# EAGLE board rosco_m68k (EAGLE 9.4.2)
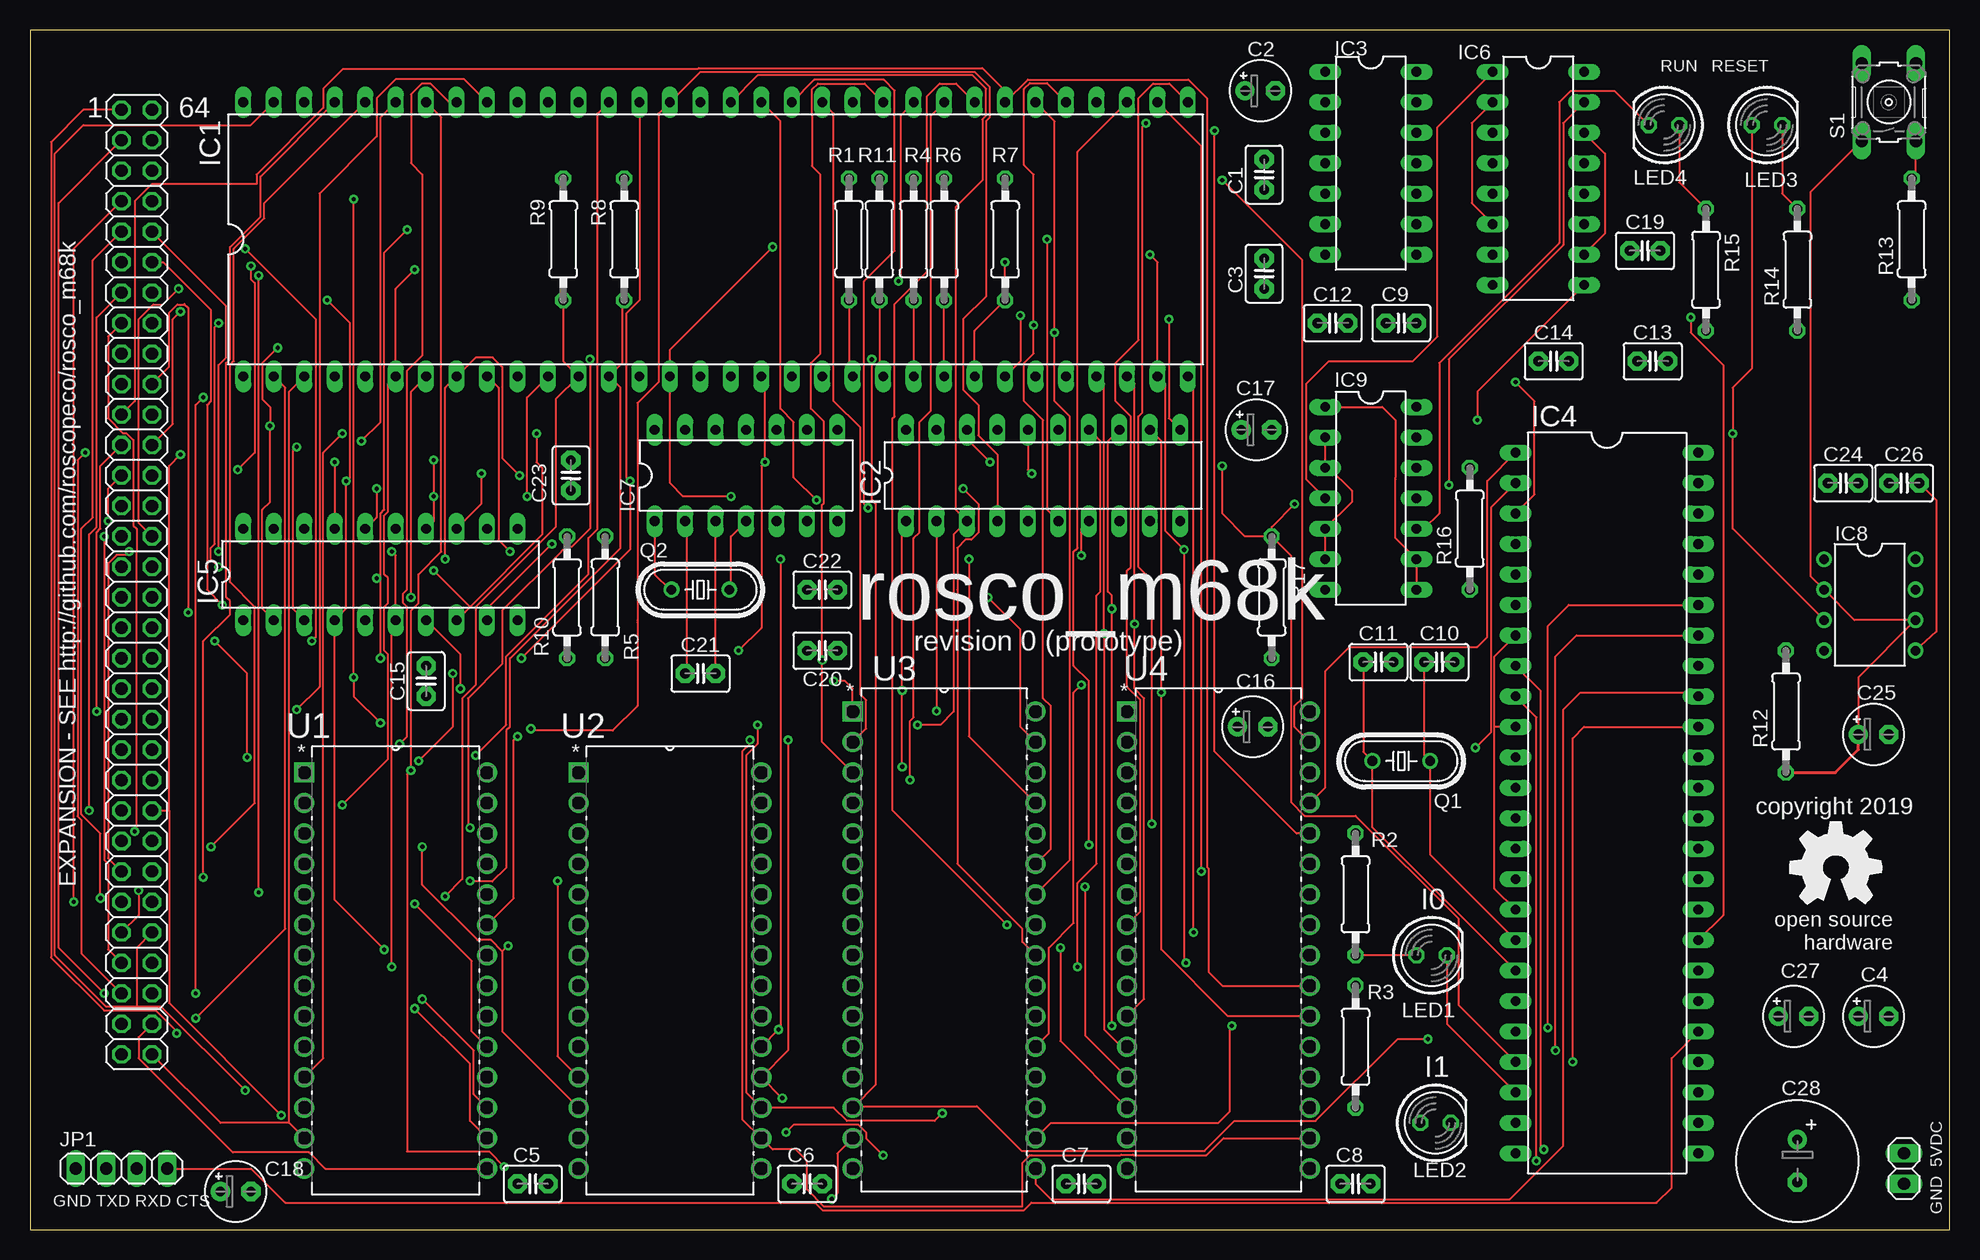
[diagram p8: board, top side]
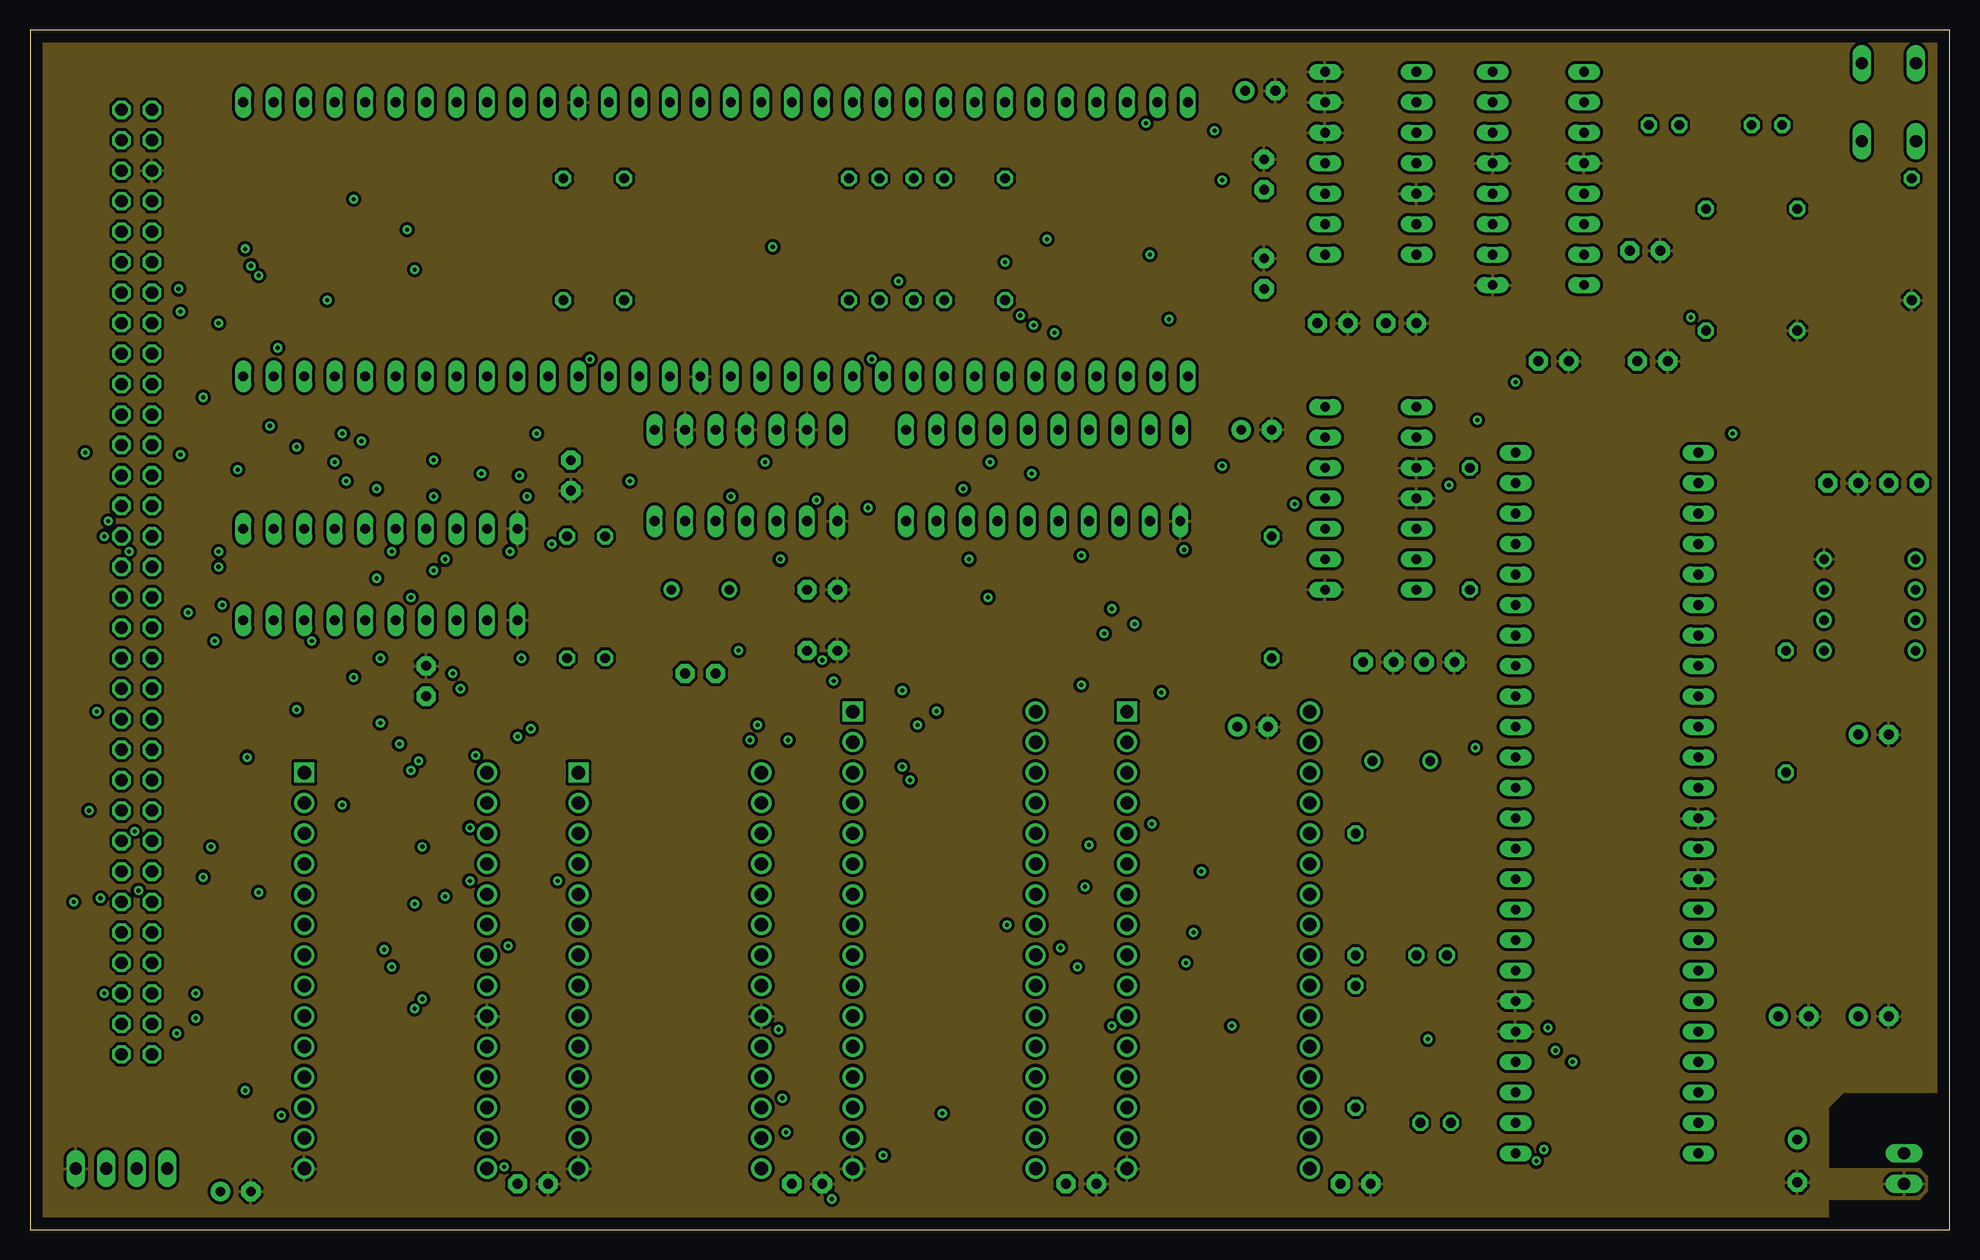
[diagram p9: board, inner layer Route2]
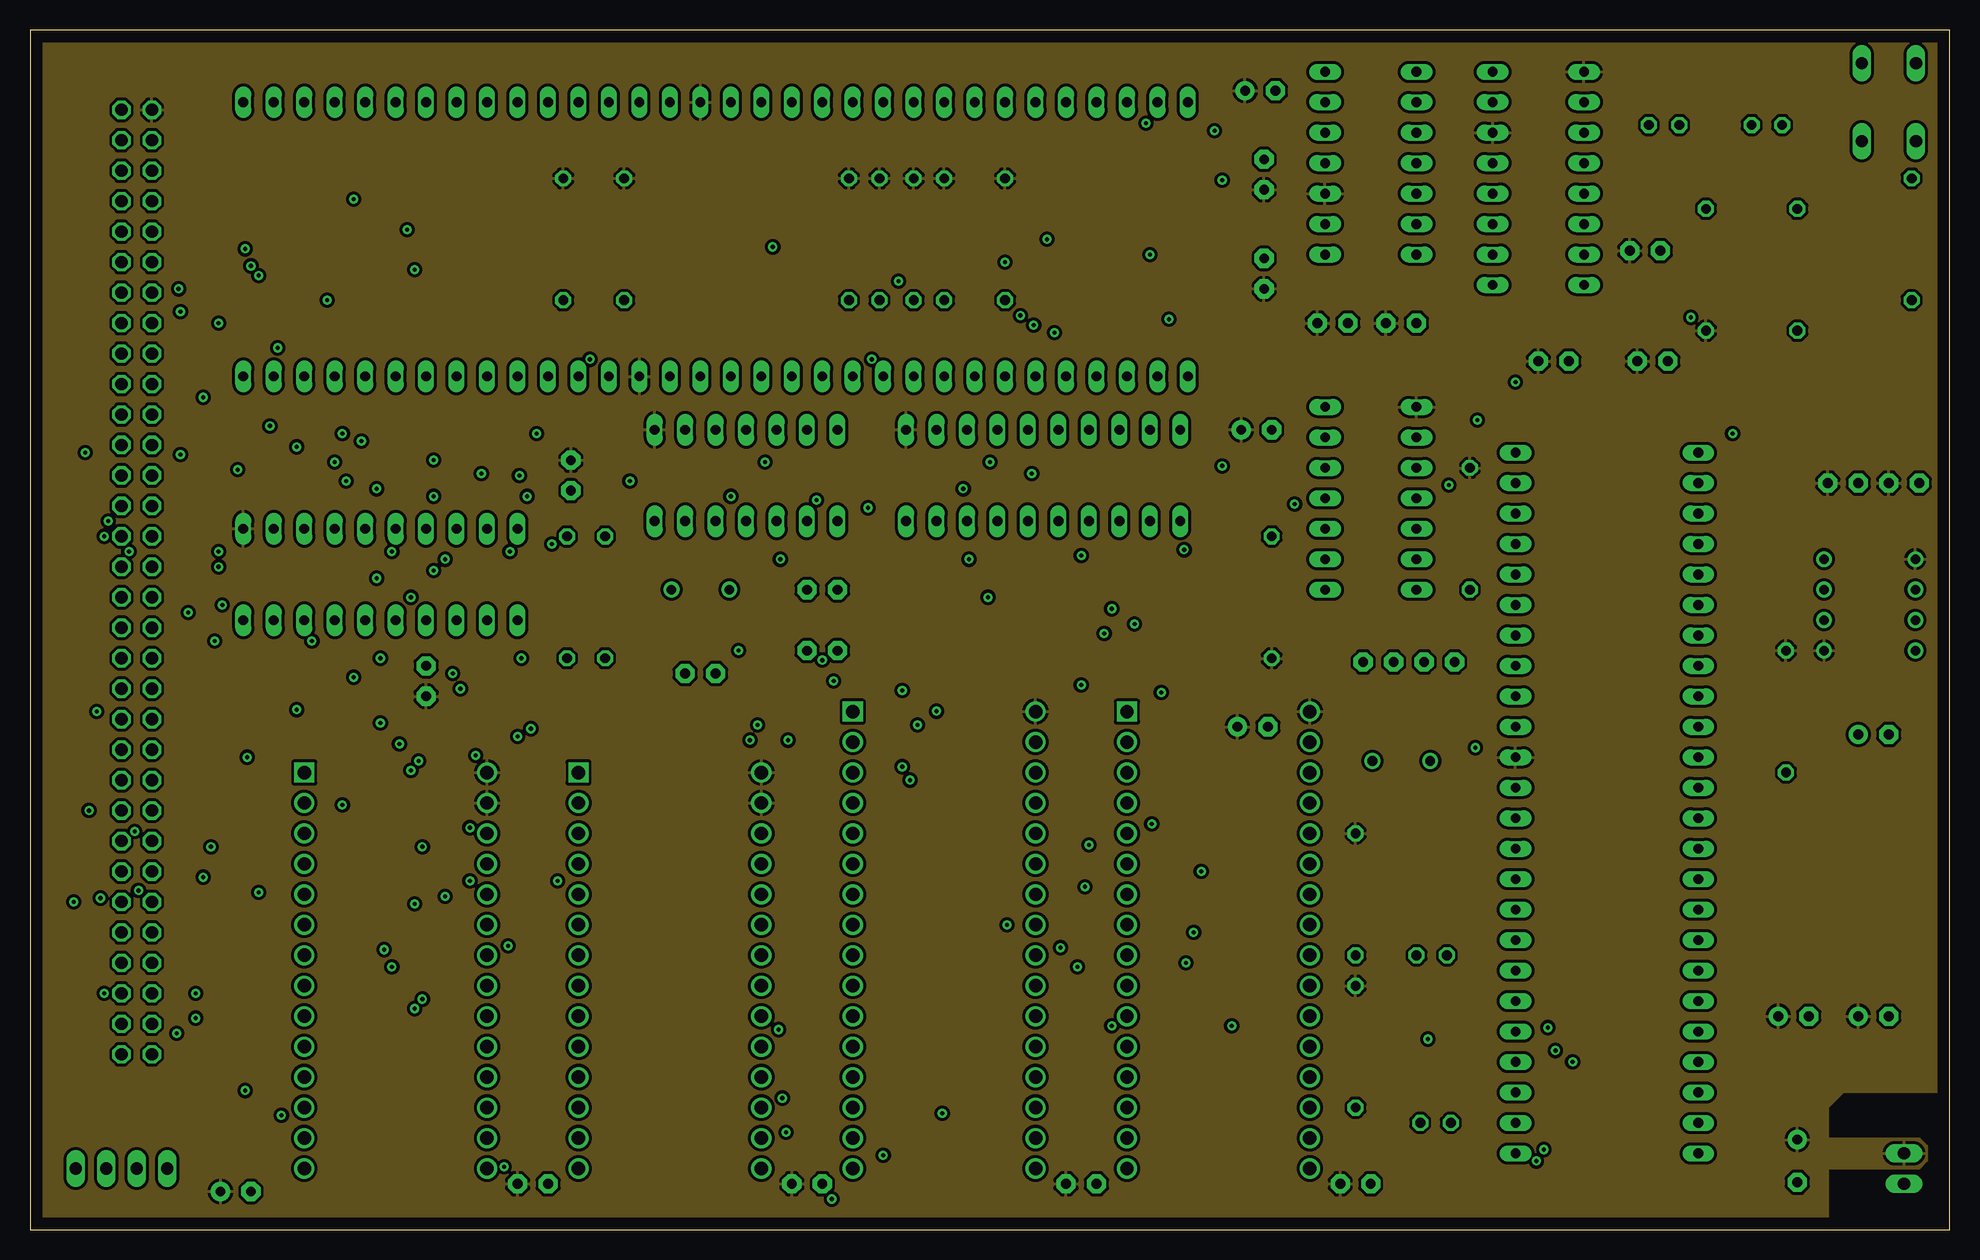
[diagram p10: board, inner layer Route15]
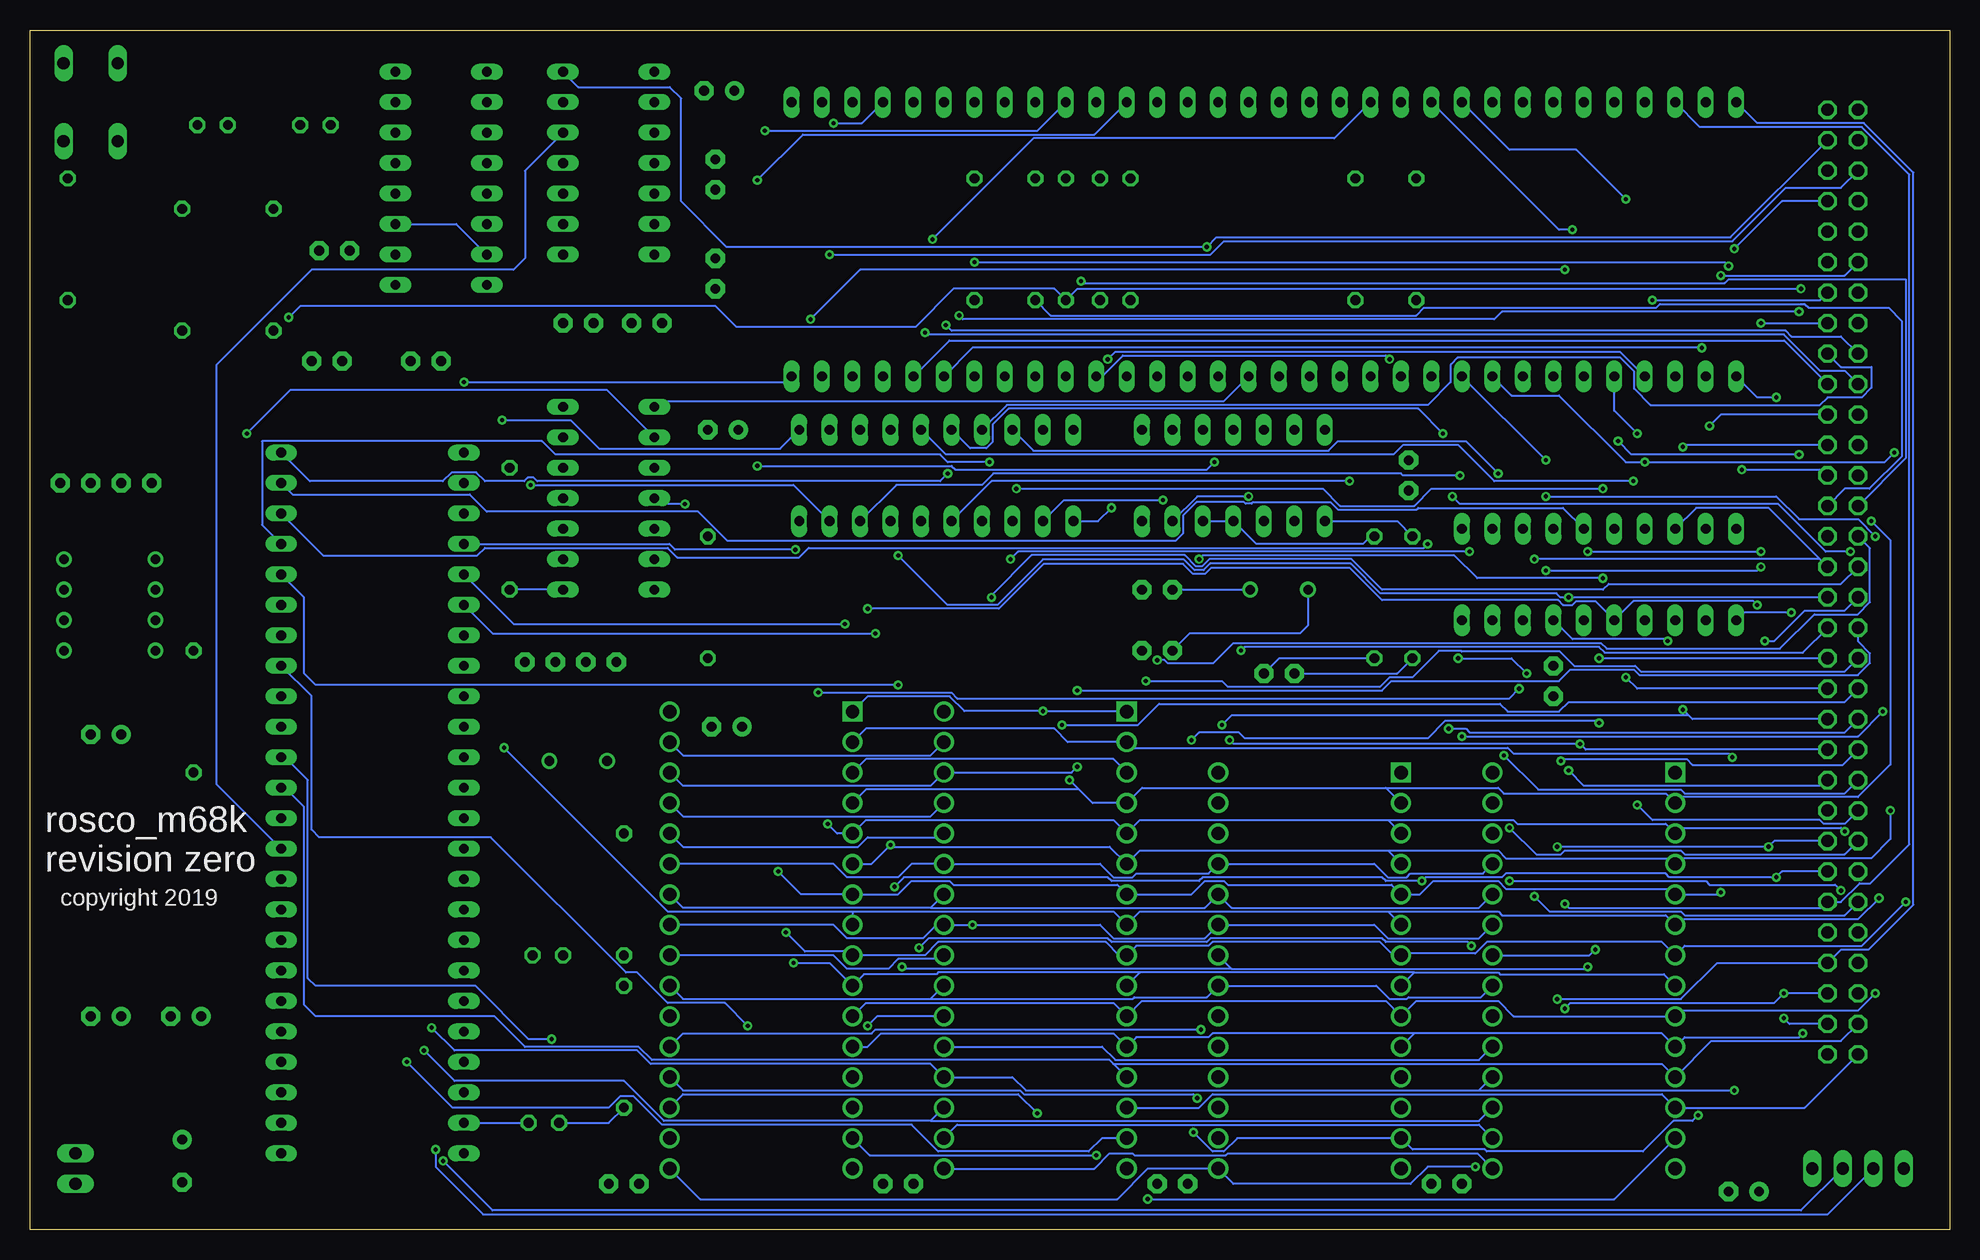
[diagram p11: board, bottom side, seen from below]

Size 160 x 100 mm. Coordinates in mm from the lower left corner, seen from the top.
Outline: 0,0 160,0 160,100 0,100 0,0
Copper layers (1+2*15+16): Top 0.035mm / dielectric 1.5mm / Route2 0.035mm / dielectric 0.15mm / Route15 0.035mm / dielectric 0.2mm / Bottom 0.035mm
Design rules "default *": minimum track width 6mil, minimum drill 0.35mm, track to track 6mil, track to pad 6mil, pad to pad 6mil, via to via 6mil, smd to smd 6mil, copper to edge 40mil, drill to drill 6mil, minimum pad ring 10mil, minimum via ring 8mil, stop-mask expansion 4mil, vias tented up to drill 0mil, thermal gap 10mil
Net classes: 1 power: width 0.254 mm, clearance 0.254 mm

## Footprints (pad centres in the part's own frame; a part is rotated, then mirrored left to right if it is on the bottom)
C2.5-3 = drill 0.813 pad 1.6 octagon: 1 -1.27,0; 2 1.27,0
E2,5-5 = drill 0.813 pad 1.6: + -1.27,0 | drill 0.813 pad 1.6 octagon: - 1.27,0
E3,5-10 = drill 0.813 pad 1.6: + -1.778,0 | drill 0.813 pad 1.6 octagon: - 1.778,0
DIL64 = drill 0.813 long: 1 -39.37,-11.43; 2 -36.83,-11.43; 3 -34.29,-11.43; 4 -31.75,-11.43; 5 -29.21,-11.43; 6 -26.67,-11.43; 7 -24.13,-11.43; 8 -21.59,-11.43; 9 -19.05,-11.43; 10 -16.51,-11.43; 11 -13.97,-11.43; 12 -11.43,-11.43; 13 -8.89,-11.43; 14 -6.35,-11.43; 15 -3.81,-11.43; 16 -1.27,-11.43; 17 1.27,-11.43; 18 3.81,-11.43; 19 6.35,-11.43; 20 8.89,-11.43; 21 11.43,-11.43; 22 13.97,-11.43; 23 16.51,-11.43; 24 19.05,-11.43; 25 21.59,-11.43; 26 24.13,-11.43; 27 26.67,-11.43; 28 29.21,-11.43; 29 31.75,-11.43; 30 34.29,-11.43; 31 36.83,-11.43; 32 39.37,-11.43; 33 39.37,11.43; 34 36.83,11.43; 35 34.29,11.43; 36 31.75,11.43; 37 29.21,11.43; 38 26.67,11.43; 39 24.13,11.43; 40 21.59,11.43; 41 19.05,11.43; 42 16.51,11.43; 43 13.97,11.43; 44 11.43,11.43; 45 8.89,11.43; 46 6.35,11.43; 47 3.81,11.43; 48 1.27,11.43; 49 -1.27,11.43; 50 -3.81,11.43; 51 -6.35,11.43; 52 -8.89,11.43; 53 -11.43,11.43; 54 -13.97,11.43; 55 -16.51,11.43; 56 -19.05,11.43; 57 -21.59,11.43; 58 -24.13,11.43; 59 -26.67,11.43; 60 -29.21,11.43; 61 -31.75,11.43; 62 -34.29,11.43; 63 -36.83,11.43; 64 -39.37,11.43
DIL20 = drill 0.813 long: 1 -11.43,-3.81; 2 -8.89,-3.81; 3 -6.35,-3.81; 4 -3.81,-3.81; 5 -1.27,-3.81; 6 1.27,-3.81; 7 3.81,-3.81; 8 6.35,-3.81; 9 8.89,-3.81; 10 11.43,-3.81; 11 11.43,3.81; 12 8.89,3.81; 13 6.35,3.81; 14 3.81,3.81; 15 1.27,3.81; 16 -1.27,3.81; 17 -3.81,3.81; 18 -6.35,3.81; 19 -8.89,3.81; 20 -11.43,3.81
DIL14 = drill 0.813 long: 1 -7.62,-3.81; 2 -5.08,-3.81; 3 -2.54,-3.81; 4 0,-3.81; 5 2.54,-3.81; 6 5.08,-3.81; 7 7.62,-3.81; 8 7.62,3.81; 9 5.08,3.81; 10 2.54,3.81; 11 0,3.81; 12 -2.54,3.81; 13 -5.08,3.81; 14 -7.62,3.81
DIL48 = drill 0.813 long: 1 -29.21,-7.62; 2 -26.67,-7.62; 3 -24.13,-7.62; 4 -21.59,-7.62; 5 -19.05,-7.62; 6 -16.51,-7.62; 7 -13.97,-7.62; 8 -11.43,-7.62; 9 -8.89,-7.62; 10 -6.35,-7.62; 11 -3.81,-7.62; 12 -1.27,-7.62; 13 1.27,-7.62; 14 3.81,-7.62; 15 6.35,-7.62; 16 8.89,-7.62; 17 11.43,-7.62; 18 13.97,-7.62; 19 16.51,-7.62; 20 19.05,-7.62; 21 21.59,-7.62; 22 24.13,-7.62; 23 26.67,-7.62; 24 29.21,-7.62; 25 29.21,7.62; 26 26.67,7.62; 27 24.13,7.62; 28 21.59,7.62; 29 19.05,7.62; 30 16.51,7.62; 31 13.97,7.62; 32 11.43,7.62; 33 8.89,7.62; 34 6.35,7.62; 35 3.81,7.62; 36 1.27,7.62; 37 -1.27,7.62; 38 -3.81,7.62; 39 -6.35,7.62; 40 -8.89,7.62; 41 -11.43,7.62; 42 -13.97,7.62; 43 -16.51,7.62; 44 -19.05,7.62; 45 -21.59,7.62; 46 -24.13,7.62; 47 -26.67,7.62; 48 -29.21,7.62
DIL16 = drill 0.813 long: 1 -8.89,-3.81; 2 -6.35,-3.81; 3 -3.81,-3.81; 4 -1.27,-3.81; 5 1.27,-3.81; 6 3.81,-3.81; 7 6.35,-3.81; 8 8.89,-3.81; 9 8.89,3.81; 10 6.35,3.81; 11 3.81,3.81; 12 1.27,3.81; 13 -1.27,3.81; 14 -3.81,3.81; 15 -6.35,3.81; 16 -8.89,3.81
DIL08 = drill 0.813 pad 1.27: 1 -3.81,-3.81; 2 -1.27,-3.81; 3 1.27,-3.81; 4 3.81,-3.81; 5 3.81,3.81; 6 1.27,3.81; 7 -1.27,3.81; 8 -3.81,3.81
1X04 = drill 1.016 long: 1 -3.81,0; 2 -1.27,0; 3 1.27,0; 4 3.81,0
1X02 = drill 1.016 long: 1 -1.27,0; 2 1.27,0
2X30 = drill 1.016 octagon: 1 -38.1,-1.27; 2 -38.1,1.27; 3 -35.56,-1.27; 4 -35.56,1.27; 5 -33.02,-1.27; 6 -33.02,1.27; 7 -30.48,-1.27; 8 -30.48,1.27; 9 -27.94,-1.27; 10 -27.94,1.27; 11 -25.4,-1.27; 12 -25.4,1.27; 13 -22.86,-1.27; 14 -22.86,1.27; 15 -20.32,-1.27; 16 -20.32,1.27; 17 -17.78,-1.27; 18 -17.78,1.27; 19 -15.24,-1.27; 20 -15.24,1.27; 21 -12.7,-1.27; 22 -12.7,1.27; 23 -10.16,-1.27; 24 -10.16,1.27; 25 -7.62,-1.27; 26 -7.62,1.27; 27 -5.08,-1.27; 28 -5.08,1.27; 29 -2.54,-1.27; 30 -2.54,1.27; 31 0,-1.27; 32 0,1.27; 33 2.54,-1.27; 34 2.54,1.27; 35 5.08,-1.27; 36 5.08,1.27; 37 7.62,-1.27; 38 7.62,1.27; 39 10.16,-1.27; 40 10.16,1.27; 41 12.7,-1.27; 42 12.7,1.27; 43 15.24,-1.27; 44 15.24,1.27; 45 17.78,-1.27; 46 17.78,1.27; 47 20.32,-1.27; 48 20.32,1.27; 49 22.86,-1.27; 50 22.86,1.27; 51 25.4,-1.27; 52 25.4,1.27; 53 27.94,-1.27; 54 27.94,1.27; 55 30.48,-1.27; 56 30.48,1.27; 57 33.02,-1.27; 58 33.02,1.27; 59 35.56,-1.27; 60 35.56,1.27
2X02 = drill 1.016 octagon: 1 -1.27,-1.27; 2 -1.27,1.27; 3 1.27,-1.27; 4 1.27,1.27
LED5MM = drill 0.813 octagon: A -1.27,0; K 1.27,0
HC49/S = drill 0.813: 1 -2.413,0; 2 2.413,0
0207/10 = drill 0.813 octagon: 1 -5.08,0; 2 5.08,0
B3F-10XX = drill 1.016 long: 1 -3.251,2.261; 2 3.251,2.261; 3 -3.251,-2.261; 4 3.251,-2.261
DIP254P1524X482-28 = drill 1.118 square: 1 -15.24,33.02 | drill 1.118: 2 -15.24,30.48; 3 -15.24,27.94; 4 -15.24,25.4; 5 -15.24,22.86; 6 -15.24,20.32; 7 -15.24,17.78; 8 -15.24,15.24; 9 -15.24,12.7; 10 -15.24,10.16; 11 -15.24,7.62; 12 -15.24,5.08; 13 -15.24,2.54; 14 -15.24,0; 15 0,0; 16 0,2.54; 17 0,5.08; 18 0,7.62; 19 0,10.16; 20 0,12.7; 21 0,15.24; 22 0,17.78; 23 0,20.32; 24 0,22.86; 25 0,25.4; 26 0,27.94; 27 0,30.48; 28 0,33.02
DIP254P1524X393-32 = drill 1.118 square: 1 -15.24,38.1 | drill 1.118: 2 -15.24,35.56; 3 -15.24,33.02; 4 -15.24,30.48; 5 -15.24,27.94; 6 -15.24,25.4; 7 -15.24,22.86; 8 -15.24,20.32; 9 -15.24,17.78; 10 -15.24,15.24; 11 -15.24,12.7; 12 -15.24,10.16; 13 -15.24,7.62; 14 -15.24,5.08; 15 -15.24,2.54; 16 -15.24,0; 17 0,0; 18 0,2.54; 19 0,5.08; 20 0,7.62; 21 0,10.16; 22 0,12.7; 23 0,15.24; 24 0,17.78; 25 0,20.32; 26 0,22.86; 27 0,25.4; 28 0,27.94; 29 0,30.48; 30 0,33.02; 31 0,35.56; 32 0,38.1

## Placement (x,y rotation side)
C1  100nF  [C2.5-3]  102.87,87.95 90 top
C2  100uF  [E2,5-5]  102.55,94.93 0 top
C3  100nF  [C2.5-3]  102.87,79.69 90 top
C4  100uF  [E2,5-5]  153.67,17.78 0 top
C5  100nF  [C2.5-3]  41.91,3.81 0 top
C6  100nF  [C2.5-3]  64.77,3.81 0 top
C7  100nF  [C2.5-3]  87.63,3.81 0 top
C8  100nF  [C2.5-3]  110.49,3.81 0 top
C9  100nF  [C2.5-3]  114.3,75.56 0 top
C10  33pF  [C2.5-3]  117.47,47.31 0 top
C11  33pF  [C2.5-3]  112.39,47.31 0 top
C12  100nF  [C2.5-3]  108.58,75.56 0 top
C13  100nF  [C2.5-3]  135.25,72.39 0 top
C14  100nF  [C2.5-3]  127,72.39 0 top
C15  100nF  [C2.5-3]  33.02,45.72 90 top
C16  100uF  [E2,5-5]  101.92,41.91 0 top
C17  100uF  [E2,5-5]  102.23,66.67 0 top
C18  100uF  [E2,5-5]  17.14,3.17 0 top
C19  100nF  [C2.5-3]  134.62,81.6 0 top
C20  22pF  [C2.5-3]  66.04,48.26 0 top
C21  100nF  [C2.5-3]  55.88,46.35 0 top
C22  22pF  [C2.5-3]  66.04,53.34 0 top
C23  100nF  [C2.5-3]  45.09,62.87 270 top
C24  100nF  [C2.5-3]  151.13,62.23 0 top
C25  100uF  [E2,5-5]  153.67,41.27 0 top
C26  100nF  [C2.5-3]  156.21,62.23 0 top
C27  100uF  [E2,5-5]  147,17.78 0 top
C28  400uF  [E3,5-10]  147.32,5.71 270 top
IC1  MC68010P10  [DIL64]  57.15,82.55 0 top
IC2  ATF16V8QL-15PU  [DIL20]  84.45,62.87 0 top
IC3  74LS93N  [DIL14]  111.76,88.9 270 top
IC4  MC68901P  [DIL48]  131.44,35.56 270 top
IC5  ATF16V8QL-15PU  [DIL20]  29.21,54.61 0 top
IC6  74LS174N  [DIL16]  125.73,87.63 270 top
IC7  74LS04N  [DIL14]  59.69,62.87 0 top
IC8  NE555N  [DIL08]  153.35,52.07 270 top
IC9  74LS01N  [DIL14]  111.76,60.96 270 top
JP1  UART  [1X04]  7.62,5.08 0 top
JP2  PWR  [1X02]  156.21,5.08 270 top
JP3  [2X30]  8.89,55.24 270 top
JP4  [2X02]  8.89,15.88 270 top
LED1  GREEN  [LED5MM]  116.84,22.86 0 top
LED2  RED  [LED5MM]  117.16,8.89 0 top
LED3  RED  [LED5MM]  144.78,92.08 0 top
LED4  GREEN  [LED5MM]  136.21,92.08 180 top
Q1  1.8432MHz  [HC49/S]  114.3,39.05 180 top
Q2  8MHz  [HC49/S]  55.88,53.34 0 top
R1  10K  [0207/10]  68.26,82.55 90 top
R2  330R  [0207/10]  110.49,27.94 90 top
R3  330R  [0207/10]  110.49,15.24 90 top
R4  4K7  [0207/10]  73.66,82.55 90 top
R5  1K2  [0207/10]  44.77,52.7 270 top
R6  4K7  [0207/10]  76.2,82.55 90 top
R7  4K7  [0207/10]  81.28,82.55 90 top
R8  4K7  [0207/10]  49.53,82.55 90 top
R9  4K7  [0207/10]  44.45,82.55 90 top
R10  1K2  [0207/10]  47.94,52.7 90 top
R11  4K7  [0207/10]  70.8,82.55 90 top
R12  2K2  [0207/10]  146.37,43.18 90 top
R13  270R  [0207/10]  156.84,82.55 90 top
R14  330R  [0207/10]  147.32,80.01 90 top
R15  330R  [0207/10]  139.7,80.01 270 top
R16  4K7  [0207/10]  120.02,58.42 90 top
R17  4K7  [0207/10]  103.5,52.7 270 top
S1  [B3F-10XX]  154.94,93.98 90 top
U1  AT28C64B-15PU  [DIP254P1524X482-28]  38.1,5.08 0 top
U2  AT28C64B-15PU  [DIP254P1524X482-28]  60.96,5.08 0 top
U3  AS6C4008-55PCN  [DIP254P1524X393-32]  83.82,5.08 0 top
U4  AS6C4008-55PCN  [DIP254P1524X393-32]  106.68,5.08 0 top
U$1  [OSHW_8MM]  150.5,30.16 0 top

## Tracks (layer width: path | path; a pad name or v marks a point on that pad's centre or on a via)
/BOOT  (via drill 0.35)
  Top 0.152: IC6.15 127.79,92.23 127.79,82.07 118.27,72.55 v118.27,62.07
  Bottom 0.152: IC2.9 96.36,62.07 v118.27,62.07
/HALT
  Top 0.152: IC9.8 IC9.9 113.82,57.63 113.82,62.55 113.82,62.71 113.82,67.47 112.71,68.58 IC9.1
  Bottom 0.152: IC1.17 60.48,69.06 107.47,69.06 IC9.1 | IC9.8 R16.1
/IACK  (via drill 0.35)
  Top 0.152: IC5.13 37.62,60.48 v37.62,63.02 | v80.01,63.98 78.11,65.88 IC2.18
  Bottom 0.152: v37.62,63.02 40.32,65.72 50.96,65.72 51.75,64.93 76.36,64.93 IC2.18 | IC4.45 140.65,58.74 140.65,65.72 117.32,65.72 116.2,64.61 84.14,64.61 83.5,63.98 v80.01,63.98
/IODTACK  (via drill 0.35)
  Top 0.152: v43.5,57.15 38.1,51.75 IC5.9
  Bottom 0.152: v43.5,57.15 43.81,56.83 95.09,56.83 95.89,56.04 106.05,56.04 106.84,56.83 122.08,56.83 122.71,56.2 135.57,56.2 IC4.46
/MFPDS
  Bottom 0.152: IC5.15 32.23,60.17 44.29,60.17 44.45,60.01 50.96,60.01 51.59,60.64 58.04,60.64 58.17,60.51 58.67,60.51 58.8,60.64 62.75,60.64 63.88,59.51 63.88,58.03 64.5,57.4 67.63,57.4 67.72,57.4 101.85,57.4 104.3,59.85 121.92,59.85 123.35,61.28 138.11,61.28 IC4.47
/RAMOE  (via drill 0.35)
  Top 0.152: IC5.16 28.89,59.37 v28.89,61.75 | v77.79,61.75 79.06,60.48 79.06,58.09 78.47,57.51 77.97,57.51 77.3,56.83 77.3,53.35 77.31,53.34 77.31,30.48 82.71,25.08 82.71,23.97 U3.24
  Bottom 0.152: v28.89,61.75 43.18,61.75 44.61,60.33 50.8,60.33 52.23,61.75 v77.79,61.75 | U4.24 93.03,22.86 91.92,21.75 88.42,21.75 87.63,22.54 84.14,22.54 U3.24
A1  (via drill 0.35)
  Top 0.152: IC1.29 89.53,70.48 v89.53,49.69 89.53,16.67 90.96,15.24 U4.12 | v12.22,16.35 12.22,16.51 10.46,18.27 6.18,18.27 1.75,22.7 1.76,22.71 1.76,90.66 4.45,93.34 JP3.1
  Bottom 0.152: IC4.6 121.44,49.69 v89.53,49.69 | U4.12 90.17,15.24 89.06,16.35 69.69,16.35 U3.12 67.79,16.03 61.75,16.03 61.44,16.35 44.61,16.35 | v12.22,16.35 12.54,16.03 22.07,16.03 U1.10 23.97,16.35 44.61,16.35 | 44.61,16.35 U2.10
A2  (via drill 0.35)
  Top 0.152: JP3.3 2.38,85.57 2.38,23.5 v6.19,19.68 | IC1.30 92.08,70.48 v92.08,50.48 92.08,45.09 92.87,44.29 92.87,19.21 U4.11
  Bottom 0.152: v6.19,19.68 7.62,18.26 22.38,18.26 U1.9 36.35,17.78 37.62,19.05 44.45,19.05 U2.9 46.99,19.05 67.31,19.05 U3.11 69.69,18.89 90.33,18.89 U4.11 | IC4.5 119.7,50.48 v92.08,50.48
A3  (via drill 0.35)
  Top 0.152: v93.34,81.28 93.98,80.64 IC1.31 94.61,70.48 94.61,58.26 v96.2,56.67 96.2,22.38 v96.36,22.23
  Bottom 0.152: U1.8 23.81,21.27 37.47,21.27 37.62,21.43 44.61,21.43 | U2.8 44.61,21.43 | 67.47,21.43 U3.10 | 44.61,21.43 67.47,21.43 | 67.47,21.43 84.3,21.43 84.45,21.27 90.49,21.27 U4.10 93.34,22.23 v96.36,22.23 | v96.2,56.67 106.25,56.67 106.7,57.13 106.71,57.14 106.72,57.15 IC4.4 | JP3.5 9.05,86.84 13.65,86.84 18.1,82.39 60.48,82.39 61.59,81.28 v93.34,81.28
A4  (via drill 0.35)
  Top 0.152: v123.83,70.64 125.41,69.06 125.41,61.28 IC4.3 | JP3.7 3.65,81.76 v3.65,27.3 | IC1.32 97,70.64 v97,24.77
  Bottom 0.152: IC1.32 97,70.64 v123.83,70.64 | v3.65,27.3 7.3,23.65 22.07,23.65 U1.7 23.97,23.97 38.58,23.97 39.53,23.02 45.56,23.02 U2.7 46.35,22.86 47.47,23.97 61.44,23.97 61.75,23.65 67.79,23.65 U3.9 69.22,22.86 70.33,23.97 84.3,23.97 85.41,22.86 U4.9 91.76,23.18 95.41,23.18 v97,24.77
A5  (via drill 0.35)
  Top 0.152: JP3.9 5.24,80.8 5.24,59.37 4.29,58.42 4.29,34.61 5.87,33.02 v5.87,27.62 | U4.8 92.55,26.51 92.55,44.13 91.44,45.24 91.44,54.93 91.76,55.24 91.76,67.79 90.49,69.06 90.49,72.23 92.41,74.15 92.41,94.32 93.61,95.53 94.97,95.53 IC1.33 | IC4.2 121.77,60.18 121.77,41.45 v120.49,40.16
  Bottom 0.152: v5.87,27.62 7.62,25.88 22.38,25.88 U1.6 23.65,26.19 37.31,26.19 37.62,26.51 46.83,26.51 | 46.83,26.51 U2.6 | 46.83,26.51 67.47,26.51 U3.8 69.69,26.51 91.44,26.51 | v120.49,40.16 106.84,26.51 91.44,26.51 | 91.44,26.51 U4.8
A6  (via drill 0.35)
  Top 0.152: v19.05,28.1 v19.05,79.53 | IC1.34 97.63,90.33 v97.63,29.84
  Bottom 0.152: JP3.11 8.73,79.53 v19.05,79.53 | v19.05,28.1 19.21,27.94 U1.5 23.34,28.42 36.99,28.42 37.62,29.05 43.02,29.05 44.13,27.94 U2.5 46.51,28.73 60.17,28.73 60.48,29.05 62.07,29.05 63.18,27.94 U3.7 69.37,28.73 83.03,28.73 83.34,29.05 86.52,29.05 87.63,27.94 U4.7 95.73,27.94 v97.63,29.84
A7  (via drill 0.35)
  Top 0.152: JP3.13 5.56,76.04 5.56,58.58 4.92,57.94 v4.92,34.92 | IC1.35 87.31,89.85 87.31,56.83 87,56.52 87,46.99 88.27,45.72 v88.27,32.07
  Bottom 0.152: 46.83,31.59 U2.4 | 46.83,31.59 67.47,31.59 U3.6 70.01,31.91 88.42,31.91 | 88.42,31.91 89.85,30.48 U4.6 | 88.42,31.91 v88.27,32.07 | 46.83,31.59 37.62,31.59 36.99,30.96 23.34,30.96 U1.4 22.38,30.96 6.51,30.96 4.92,32.54 v4.92,34.92
A8  (via drill 0.35)
  Top 0.152: JP3.15 6.51,74.45 6.51,67.63 7.74,66.4 8.03,66.4 8.61,65.81 8.61,58.7 8.89,58.42 8.89,56.54 8.86,56.52 8.86,33.31 v8.73,33.18 | v93.03,92.23 92.71,91.92 92.71,68.1 92.39,67.79 92.39,55.24 93.5,54.13 v93.5,33.81
  Bottom 0.152: v8.73,33.18 9.05,33.5 22.38,33.5 U1.3 23.65,33.81 36.04,33.81 36.35,34.13 46.83,34.13 | 46.83,34.13 U2.3 | 46.83,34.13 67.47,34.13 U3.5 69.69,34.13 90.33,34.13 U4.5 92.71,33.02 v93.5,33.81 | IC1.36 90.65,92.23 v93.03,92.23
A9  (via drill 0.35)
  Top 0.152: IC1.37 84.77,95.57 83.34,95.57 82.87,95.09 82.87,88.74 83.66,87.95 v83.66,75.41 83.66,73.03 82.87,72.23 82.87,69.06 84.45,67.47 84.45,44.29 85.09,43.66 85.09,31.75 U3.27
  Bottom 0.152: U1.25 38.89,29.69 44.93,29.69 45.24,29.37 46.83,29.37 47.94,30.48 U2.25 61.75,29.69 67.79,29.69 68.1,29.37 69.69,29.37 70.8,30.48 U3.27 86.52,30.48 87.63,29.37 91.92,29.37 93.03,30.48 U4.27 | JP3.17 9.05,74.45 13.18,74.45 13.65,74.93 83.19,74.93 v83.66,75.41
A10  (via drill 0.35)
  Top 0.152: IC1.38 85.41,92.39 v85.41,74.77 85.41,69.06 86.68,67.79 86.68,30.8 U3.26
  Bottom 0.152: U1.24 39.21,26.83 59.85,26.83 U2.24 62.07,26.83 84.93,26.83 | JP3.19 8.73,71.6 10.79,71.6 13.81,74.61 85.25,74.61 v85.41,74.77 | U4.26 105.57,26.83 84.93,26.83 | U3.26 84.93,26.83
A11
  Top 0.152: JP3.21 8.73,69.06 8.73,85.72 10.16,87.15 18.89,87.15 18.89,87.95 24.45,93.5 24.45,95.09 26.11,96.76 55.69,96.76 55.75,96.83 79.39,96.83 81.28,94.93 IC1.39 83.17,95.87 96.55,95.87 98.11,94.31 98.11,30.23 98.24,30.1 98.24,21.46 99.38,20.32 U4.23
  Bottom 0.152: U1.21 39.05,19.37 45.09,19.37 45.24,19.21 46.67,19.21 47.78,20.32 U2.21 61.91,19.37 67.94,19.37 68.1,19.21 84.93,19.21 | 84.93,19.21 U3.23 | 84.93,19.21 105.57,19.21 U4.23
A12  (via drill 0.35)
  Top 0.152: JP3.23 5.87,63.66 5.87,58.42 5.56,58.1 v5.56,43.18 | v40.64,41.12 40.32,40.8 40.32,27.62 U1.23 | v81.44,25.4 71.91,34.92 71.91,67.63 72.07,67.79 72.07,77.15 74.78,79.86 74.78,94.48 75.83,95.53 77.19,95.53 IC1.40
  Bottom 0.152: v5.56,43.18 7.62,41.12 v40.64,41.12 | U4.25 93.03,25.4 91.92,24.29 85.57,24.29 84.45,25.4 U3.25 v81.44,25.4 70.8,25.4 69.69,24.29 62.07,24.29 U2.23 47.94,25.4 46.83,24.29 39.21,24.29 U1.23
A13  (via drill 0.35)
  Top 0.152: JP3.25 6.51,61.75 v6.51,59.05 | IC1.41 75.09,92.87 75.09,68.26 74.14,67.31 74.14,58.1 73.66,57.63 73.66,42.7 73.34,42.39 v73.34,37.47
  Bottom 0.152: v6.51,59.05 4.92,57.47 4.92,38.76 7.63,36.05 22.37,36.05 22.38,36.04 22.7,35.72 U1.2 23.65,36.35 37.15,36.35 37.62,36.83 46.99,36.83 | 72.55,36.67 71.44,35.56 U3.4 67.31,36.83 46.99,36.83 | 72.55,36.67 v73.34,37.47 | 46.99,36.83 U2.2 | U4.4 90.33,36.67 72.55,36.67
A14  (via drill 0.35)
  Top 0.152: v98.74,91.6 98.74,39.85 105.57,33.02 U4.28 | v72.39,79.06 72.55,79.22 72.55,92.87 IC1.42
  Bottom 0.152: IC1.42 76.04,91.6 v98.74,91.6 | JP3.27 3.65,64.29 3.65,79.22 18.41,79.22 18.73,78.9 72.23,78.9 v72.39,79.06 | U3.28 84.14,32.7 90.17,32.7 90.96,31.91 105.57,31.91 U4.28
A15  (via drill 0.35)
  Top 0.152: U3.3 66.04,40.64 v66.04,47.47 66.04,60.42 66.15,60.53 66.17,60.55 66.17,67.34 65.09,68.42 65.09,72.23 65.88,73.03 65.88,87.95 65.17,88.66 65.17,92.94 65.15,92.95 65.15,95.01 65.67,95.53 69.57,95.53 IC1.43
  Bottom 0.152: U4.3 90.33,39.21 69.69,39.21 U3.3 | JP3.29 6.63,56.79 6.63,52.3 7.63,51.29 11.26,51.29 14.13,48.42 28.57,48.42 29.05,48.9 59.69,48.9 61.35,47.23 65.2,47.23 65.43,47.47 v66.04,47.47
A16  (via drill 0.35)
  Top 0.152: v79.85,52.7 82.55,50.01 82.55,41.91 U3.31 | v99.38,87.47 106.05,80.8 106.05,44.29 105.41,43.66 105.41,41.91 U4.31
  Bottom 0.152: JP3.31 9.05,53.82 28.42,53.82 28.89,53.34 47.31,53.34 49.85,55.88 61.69,55.88 62.3,55.27 62.8,55.27 63.74,56.21 76.5,56.21 79.85,52.86 v79.85,52.7 | IC1.44 71.28,91.28 95.57,91.28 v99.38,87.47 | U3.31 84.93,39.53 105.57,39.53 U4.31
A17  (via drill 0.35)
  Top 0.152: IC1.45 66.99,93.03 66.99,69.06 69.22,66.83 69.22,44.61 69.69,44.13 69.69,41.75 U3.2 | v15.4,49.05 18.1,46.35 v18.1,39.37
  Bottom 0.152: JP3.33 8.73,51.59 12.06,51.59 14.61,49.05 v15.4,49.05 | v18.1,39.37 18.41,39.69 36.35,39.69 36.83,40.16 68.1,40.16 U3.2 73.5,40.64 74.61,41.75 90.33,41.75 U4.2
A18  (via drill 0.35)
  Top 0.152: IC2.1 72.71,58.74 v72.71,44.93 v72.71,38.58 | v69.85,60.17 69.53,60.48 69.53,79.06 72.07,81.6 72.07,94.94 71.18,95.83 65.35,95.83 IC1.46
  Bottom 0.152: v72.71,38.58 73.18,38.1 U3.30 84.93,36.99 105.57,36.99 U4.30 | v69.85,60.17 70.96,59.05 IC2.1 | v72.71,44.93 47.31,44.93 46.51,45.72 32.54,45.72 31.59,46.67 26.31,46.67 25.84,46.21 7.63,46.21 6.63,47.22 6.63,48.03 7.62,49.03 JP3.35
A19  (via drill 0.35)
  Top 0.152: IC2.2 v75.56,43.21 | IC1.47 62.55,92.39 62.55,68.42 63.66,67.31 63.66,62.71 v65.56,60.8 | v66.99,45.72 67.94,45.72 68.58,45.09 U3.1
  Bottom 0.152: v65.56,60.8 73.82,60.8 IC2.2 | JP3.37 8.73,46.51 25.72,46.51 26.19,46.99 31.27,46.99 32.46,48.18 40.66,48.18 40.71,48.23 42.57,48.23 44.78,46.02 46.69,46.02 47.47,45.24 60.17,45.24 60.64,45.72 v66.99,45.72 | U4.1 90.17,44.45 83.34,44.45 82.11,43.21 v75.56,43.21 75.53,43.18 U3.1
A20  (via drill 0.35)
  Top 0.152: v73.98,42.07 75.88,42.07 76.99,43.18 76.99,57.94 IC2.3 77.15,60.01 77.15,85.25 79.38,87.47 79.38,92.55 79.69,92.87 79.69,95.09 78.57,96.22 60.66,96.22 IC1.48
  Bottom 0.152: JP3.39 8.73,43.97 31.75,43.97 32.54,43.18 36.83,43.18 37.47,43.81 65.88,43.81 67.63,42.07 v73.98,42.07
A21  (via drill 0.35)
  Top 0.152: IC2.4 80.64,64.61 79.06,66.2 79.06,68.74 77.79,70.01 77.79,75.88 79.69,77.79 79.69,92.39 80.01,92.71 80.01,95.25 78.74,96.52 55.88,96.52 IC1.50 52.39,93.03 52.39,70.64 50.64,68.9 50.64,50.8 50.64,50.64 50.64,43.66 48.58,41.59 41.91,41.59 v41.75,41.75
  Bottom 0.152: JP3.41 8.73,41.43 40.01,41.43 40.32,41.75 v41.75,41.75
A22  (via drill 0.35)
  Top 0.152: IC1.51 50.8,77.47 49.69,76.36 49.69,62.71 v50.01,62.39 50.01,56.67 v40.96,47.62 | v32.38,39.05 35.24,41.91 v35.24,46.35
  Bottom 0.152: IC2.5 79.85,62.39 v50.01,62.39 | JP3.43 8.89,38.73 21.43,38.73 21.91,39.21 32.23,39.21 v32.38,39.05 | v35.24,46.35 36.51,47.62 v40.96,47.62
A23  (via drill 0.35)
  Top 0.152: IC2.6 84.77,60.01 v84.77,82.55 | v37.15,39.53 39.69,42.07 39.69,47.78 46.56,54.66 46.56,57.66 47.31,58.41 47.31,93.03 IC1.52
  Bottom 0.152: v84.77,82.55 76.36,90.96 51.28,90.96 IC1.52 | JP3.45 8.73,36.35 22.07,36.35 22.38,36.67 34.29,36.67 v37.15,39.53
AS  (via drill 0.35)
  Top 0.152: IC6.9 120.65,69.85 v120.65,67.47 | v26.04,35.4 29.84,39.21 29.84,47.94 29.53,48.26 29.53,51.91 29.84,52.23 29.84,54.29 29.53,54.61 29.53,59.53 29.84,59.85 29.84,70.48 IC1.6 30.48,78.42 v32.07,80.01 | IC2.11 94.93,67.63 v94.93,75.88
  Bottom 0.152: IC2.11 97.47,65.09 112.55,65.09 114.94,67.47 v120.65,67.47 | v26.04,35.4 24.77,34.13 10.79,34.13 10.48,33.81 8.73,33.81 JP3.47 | v94.93,75.88 90.81,80.01 v32.07,80.01
BERR  (via drill 0.35)
  Top 0.152: R11.1 70.8,71.44 IC1.22 | v36.67,33.5 36.51,33.66 36.51,44.29 39.37,47.15 39.37,51.59 44.21,56.44 44.29,56.52 44.67,56.9 45.14,56.9 46.67,58.43 46.67,61.44 46.67,61.59 v46.67,72.55
  Bottom 0.152: JP3.49 8.73,31.27 22.07,31.27 22.38,31.59 32.07,31.59 32.38,31.27 34.45,31.27 v36.67,33.5 | v46.67,72.55 46.99,72.87 68.9,72.87 70.64,71.12 IC1.22
BG  (via drill 0.35)
  Top 0.152: IC1.11 41.43,69.37 v41.43,61.12 | JP3.51 6.51,30.96 6.51,55.53 7.21,56.24 7.98,56.24 v8.26,56.52
  Bottom 0.152: v41.43,61.12 40.8,60.48 14.29,60.48 10.32,56.52 v8.26,56.52
BGACK  (via drill 0.35)
  Top 0.152: R9.1 44.45,72.39 IC1.12 43.81,69.22 43.81,58.58 37.15,51.91 37.15,45.4 36.04,44.29 36.04,29.21 v34.61,27.78
  Bottom 0.152: JP3.53 8.73,26.19 22.07,26.19 22.38,26.51 33.34,26.51 v34.61,27.78
BR  (via drill 0.35)
  Top 0.152: R8.1 49.37,77.31 49.37,72.23 IC1.13 49.21,70.17 49.21,56.83 40.01,47.62 40.01,41.91 39.69,41.59 39.69,30.16 38.53,29.01 36.72,29.01 v36.67,29.05 | JP3.55 9.05,26.19 v9.05,28.26
  Bottom 0.152: v9.05,28.26 9.53,28.73 20,28.73 20.32,29.05 v36.67,29.05
CLK  (via drill 0.35)
  Top 0.152: v61.91,81.92 53.34,73.34 IC1.15 53.34,62.23 54.45,61.12 v58.42,61.12
  Bottom 0.152: IC7.6 62.71,61.12 v58.42,61.12 | JP3.4 18.26,82.71 61.12,82.71 v61.91,81.92 101.92,81.92 105.73,85.72 105.73,94.3 106.68,95.25 114.3,95.25 IC3.14
D0  (via drill 0.35)
  Top 0.152: v26.04,66.36 24.45,64.77 24.45,14.29 U1.11
  Bottom 0.152: JP4.1 9.05,15.72 19.84,15.72 U1.11 23.97,13.81 69.69,13.81 | U3.13 69.69,13.81 | 69.69,13.81 70.01,14.13 108.15,14.13 109.25,15.23 118.73,15.23 121.28,17.78 136.21,17.78 137.16,18.73 137.16,35.24 138.75,36.83 IC4.37 | v26.04,66.36 27.94,68.26 IC1.5
D1  (via drill 0.35)
  Top 0.152: v116.52,15.88 113.98,15.88 107.16,9.05 100.4,9.05 97.9,6.55 82.66,6.55 78.93,10.29 68.71,10.29 | v70.17,72.55 70.17,60.8 70.48,60.48 70.48,12.06 68.71,10.29 | U3.14 68.71,10.29
  Bottom 0.152: JP4.3 12.06,10.16 U1.12 23.97,11.27 61.44,11.27 62.55,10.16 U3.14 | IC1.4 27.46,73.18 69.53,73.18 v70.17,72.55 | v116.52,15.88 118.43,15.88 122.87,20.32 136.21,20.32 136.84,20.95 136.84,37.47 138.75,39.37 IC4.38
D2  (via drill 0.35)
  Top 0.152: IC1.3 21.59,69.85 21.59,8.89 | U1.13 21.59,8.89 | JP4.4 15.88,8.89 21.59,8.89 | v66.83,2.54 67.31,3.02 67.31,6.35 U3.15 | v128.59,13.97 128.59,40.96 129.54,41.91 IC4.39
  Bottom 0.152: U3.15 70.64,7.62 71.75,6.51 84.3,6.51 86.52,8.73 107.31,8.73 109.7,11.11 110.81,11.11 111.76,10.16 124.78,10.16 v128.59,13.97 | U1.13 27.94,2.54 v66.83,2.54
D3  (via drill 0.35)
  Top 0.152: IC1.2 21.27,70.17 21.27,25.08 v13.81,17.62 | JP4.2 9.05,16.03 9.05,14.29 16.91,6.43 23.26,6.43 24.61,5.08 U1.15 | U3.17 83.82,3.81 85.09,2.54 123.35,2.54 127.79,6.99 127.79,33.02 127.79,33.18 127.79,43.34 129.22,44.77 138.75,44.77 IC4.40
  Bottom 0.152: v13.81,17.62 13.34,17.14 JP4.2 | U1.15 39.37,6.35 60.17,6.35 60.33,6.19 67.94,6.19 68.1,6.35 70.01,6.35 71.28,5.08 U3.17
D4  (via drill 0.35)
  Top 0.152: v14.45,69.37 13.81,68.74 v13.81,19.68 | v32.07,18.41 36.67,13.81 36.67,9.05 U1.16 | U3.18 85.09,8.89 99.06,8.89 100.01,9.84 100.01,16.83 v100.17,16.99
  Bottom 0.152: IC1.1 16.03,69.37 v14.45,69.37 | JP3.60 v13.81,19.68 14.61,18.89 31.59,18.89 v32.07,18.41 | v100.17,16.99 102.08,18.89 106.84,18.89 109.38,21.43 110.33,21.43 121.6,32.7 135.89,32.7 136.54,33.35 136.54,44.46 IC4.41 | U1.16 39.21,8.73 82.71,8.73 U3.18
D5  (via drill 0.35)
  Top 0.152: v32.7,19.21 36.99,14.92 36.99,11.27 U1.17 | IC4.42 128.91,49.53 127.16,47.78 v127.16,14.92
  Bottom 0.152: IC1.64 16.03,92.23 7.14,92.23 3.02,88.11 3.02,27.08 6.75,23.35 9.04,23.35 JP3.58 19.37,22.23 22.38,19.21 v32.7,19.21 | v127.16,14.92 124.62,12.38 110.49,12.38 107.16,9.05 84.93,9.05 | U3.19 84.93,9.05 | U1.17 39.21,9.05 84.93,9.05
D6  (via drill 0.35)
  Top 0.152: IC1.63 18.41,92.08 4.45,92.08 2.06,89.69 2.06,22.86 6.35,18.57 8.89,18.57 | 8.89,18.57 10.95,18.57 v17.94,11.59 | JP3.56 8.89,23.5 8.89,18.57 | IC4.43 128.27,52.07 126.52,50.32 v126.52,16.83
  Bottom 0.152: v126.52,16.83 124.62,14.92 109.38,14.92 108.27,13.81 84.93,13.81 U3.20 78.11,12.7 76.99,11.59 39.21,11.59 | 39.21,11.59 U1.18 | 39.21,11.59 v17.94,11.59
D7  (via drill 0.35)
  Top 0.152: v87.63,45.4 87,44.77 87,25.56 84.93,23.5 84.93,16.35 U3.21 | v32.07,27.15 36.83,22.38 36.83,16.51 U1.19
  Bottom 0.152: IC1.62 20.8,91.92 7.3,91.92 3.33,87.95 3.33,32.11 6.59,28.85 7.5,28.85 9.05,27.3 JP3.54 10.64,26.83 31.75,26.83 v32.07,27.15 | U1.19 39.21,14.13 69.53,14.13 70.64,15.24 U3.21 | IC4.44 137.16,52.7 137.16,46.35 136.21,45.4 v87.63,45.4
D8  (via drill 0.35)
  Top 0.152: IC1.61 19.21,87.79 19.21,84.45 16.67,81.92 16.67,72.55 16.35,72.23 16.35,52.7 16.67,52.39 16.67,51.28 14.45,49.05 v14.45,29.37 | U2.11 43.97,14.45 v43.97,29.05 | U4.13 87.95,16.19 v87.95,28.57
  Bottom 0.152: JP3.52 13.97,29.84 v14.45,29.37 23.34,29.37 23.65,29.69 36.99,29.69 37.31,29.37 43.66,29.37 v43.97,29.05 46.99,29.05 47.31,29.37 62.23,29.37 62.55,29.05 69.85,29.05 70.17,29.37 87.15,29.37 v87.95,28.57
D9  (via drill 0.35)
  Top 0.152: IC1.60 19.53,85.57 19.53,84.3 16.99,81.76 16.99,72.39 16.67,72.07 16.67,53.98 18.73,51.91 18.73,35.56 v15.08,31.91 | U2.12 39.37,16.51 39.37,23.18 | 39.37,23.18 38.42,24.13 37.31,24.13 32.7,28.73 v32.7,31.91 | U4.14 85.88,15.72 v85.88,23.5 | 39.37,23.18 v39.85,23.65
  Bottom 0.152: JP3.50 14.61,32.38 v15.08,31.91 v32.7,31.91 | v85.88,23.5 85.09,24.29 70.17,24.29 69.85,23.97 61.91,23.97 61.59,24.29 47.31,24.29 46.99,23.97 40.16,23.97 v39.85,23.65
D10  (via drill 0.35)
  Top 0.152: IC1.59 29.21,92.71 29.21,67.31 v27.62,65.72 | v12.54,64.61 11.59,63.66 11.59,34.92 | v71.12,6.19 69.69,7.62 69.69,8.1 69.06,8.73 63.66,8.73 v63.02,8.1 | 11.59,34.92 11.59,18.89 v20.95,9.53 | JP3.48 11.59,34.92
  Bottom 0.152: v27.62,65.72 26.51,64.61 v12.54,64.61 | v20.95,9.53 21.43,9.05 23.02,9.05 25.56,6.51 38.58,6.51 38.73,6.67 44.77,6.67 U2.13 59.37,7.62 60.48,6.51 61.44,6.51 v63.02,8.1 | U4.15 90.01,6.19 v71.12,6.19
D11  (via drill 0.35)
  Top 0.152: IC1.58 34.29,92.71 34.29,56.52 32.38,54.61 32.38,52.23 31.75,51.59 v31.75,38.26 31.43,37.94 31.43,6.51 38.26,6.51 v39.53,5.24
  Bottom 0.152: U4.17 104.14,2.54 69.37,2.54 66.83,5.08 U2.15 59.69,3.81 44.93,3.81 43.5,5.24 v39.53,5.24 | v31.75,38.26 30.48,36.99 10.64,36.99 JP3.46
D12  (via drill 0.35)
  Top 0.152: v30.8,40.48 31.43,41.12 31.43,51.91 31.11,52.23 31.11,53.02 31.43,53.34 31.43,71.6 32.7,72.87 32.7,87.95 31.75,88.9 31.75,94.63 32.65,95.53 33.39,95.53 34.94,93.98 IC1.57 | v60.01,40.8 60.01,40.48 59.37,39.85 59.37,9.21 U2.16 61.91,6.67 63.82,6.67 64.77,5.71 64.77,3.33 66.2,1.91 82.71,1.91 82.71,5.56 83.34,6.19 83.5,6.19 90.9,6.19 90.96,6.25 91.92,6.25 91.98,6.19 98.06,6.19 99.49,7.62 U4.18
  Bottom 0.152: JP3.44 30.32,40.01 v30.8,40.48 59.69,40.48 v60.01,40.8
D13  (via drill 0.35)
  Top 0.152: IC1.56 36.2,95.89 30.47,95.89 28.91,94.32 28.91,91.14 24.13,86.36 24.13,45.24 v22.23,43.34 | v60.64,42.07 60.64,40.48 59.69,39.53 59.69,11.43 U2.17 66.99,10.16 68.1,9.05 75.41,9.05 v76.04,9.68
  Bottom 0.152: v76.04,9.68 77.63,11.27 105.57,11.27 U4.19 | 21.75,42.86 21.43,42.55 JP3.42 | 21.75,42.86 v22.23,43.34 | v60.64,42.07 59.85,42.86 21.75,42.86
D14  (via drill 0.35)
  Top 0.152: v62.71,10.95 U2.18 63.18,14.92 v63.18,40.8 | v26.99,85.88 v26.99,46.04 26.99,44.45 v29.21,42.23
  Bottom 0.152: v62.71,10.95 63.02,11.27 77.15,11.27 77.47,11.59 105.57,11.59 U4.20 | IC1.55 36.67,90.01 31.11,90.01 v26.99,85.88 | v26.99,46.04 26.04,45.09 JP3.40 | v63.18,40.8 62.55,41.43 59.21,41.43 58.74,40.96 43.5,40.96 42.07,42.39 29.37,42.39 v29.21,42.23
D15  (via drill 0.35)
  Top 0.152: U2.19 v62.39,16.67 62.55,16.83 v62.55,55.88 | v31.43,83.34 29.53,81.44 29.53,60.01 29.21,59.69 29.21,54.29 | v29.21,47.62 29.21,54.29 | 29.21,54.29 v28.89,54.29
  Bottom 0.152: v62.39,16.67 89.53,16.67 89.85,16.35 105.57,16.35 U4.21 | IC1.54 32.54,83.34 v31.43,83.34 | JP3.38 v29.21,47.62 | v28.89,54.29 39.37,54.29 41.27,56.2 62.23,56.2 v62.55,55.88
DTACK  (via drill 0.35)
  Top 0.152: IC5.14 33.66,59.05 v33.66,61.12 v33.66,64.14 | JP3.57 6.51,23.34 6.51,30.48 6.19,30.8 v6.19,57.78
  Bottom 0.152: IC1.10 v33.66,64.14 | v6.19,57.78 7.62,59.21 12.54,59.21 14.45,61.12 v33.66,61.12
EVENRAMSEL  (via drill 0.35)
  Top 0.152: v23.5,49.05 23.81,49.37 23.81,75.88 v17.94,81.76 | IC2.12 94.3,65.72 v94.3,44.77 94.3,23.34 99.85,17.78 U4.22 | IC5.7 35.88,47.94 v35.88,45.09
  Bottom 0.152: IC5.7 31.43,49.21 23.65,49.21 v23.5,49.05 | v17.94,81.76 13.97,85.72 JP3.8 | v35.88,45.09 36.67,44.29 82.71,44.29 83.19,44.77 v94.3,44.77
EVENROMSEL  (via drill 0.35)
  Top 0.152: v30.16,21.91 30.16,50.48 IC5.6 30.48,56.2 v30.16,56.52 | IC2.14 89.22,65.72 89.22,53.18 88.9,52.86 88.9,30.48 87.31,28.89 v87.31,21.91 | JP3.10 16.35,76.99 16.35,72.71 15.72,72.07 v15.72,56.52
  Bottom 0.152: v30.16,21.91 30.32,21.75 59.85,21.75 | U2.22 59.85,21.75 | v87.31,21.91 87.15,21.75 59.85,21.75 | v30.16,56.52 v15.72,56.52
EXPSEL
  Bottom 0.152: IC2.17 78.58,68.74 43.5,68.74 41.59,70.64 41.59,72.07 41.53,72.14 41.53,72.15 41.01,72.67 27.43,72.67 26.29,71.53 26.29,70.09 24.94,68.74 10.79,68.74 10.16,69.37 7.3,69.37 6.51,70.17 6.51,71.91 9.05,71.91 JP3.18
FC0  (via drill 0.35)
  Top 0.152: v13.18,51.44 13.18,76.83 12.86,77.15 12.83,77.12 12.29,77.12 11.6,76.44 11.6,71.93 JP3.20
  Bottom 0.152: IC5.1 17.14,51.44 v13.18,51.44 | IC1.28 83.37,74.11 13.78,74.11 JP3.20
FC1  (via drill 0.35)
  Top 0.152: IC5.2 19.37,51.75 19.37,60.01 20,60.64 v20,66.99 20,68.58 19.37,69.22 19.37,72.23 v20.64,73.5
  Bottom 0.152: v20,66.99 19.05,67.94 JP3.22 | v20.64,73.5 81.44,73.5 IC1.27
FC2  (via drill 0.35)
  Top 0.152: IC5.3 21.91,51.75 21.91,64.93 v22.23,65.25 | IC1.26 82.55,72.39 v82.55,76.2 | v12.54,76.52 11.91,75.88 11.91,67.15 JP3.24
  Bottom 0.152: v22.23,65.25 22.07,65.41 JP3.24 | v82.55,76.2 82.23,75.88 37.94,75.88 37.31,76.52 v12.54,76.52
GND
  pour Route2: 0,99.69 160.02,99.69 160.02,12.06 159.38,11.43 151.13,11.43 149.86,10.16 149.86,8.26 149.86,0 0,0
  pour Route2: 149.86,5.08 157.48,5.08 158.12,4.45 158.12,3.17 157.48,2.54 149.86,2.54
IOSEL  (via drill 0.35)
  Top 0.152: 36.67,51.91 42.7,57.94 42.7,63.5 42.23,63.98 v42.23,66.36 | 36.67,51.91 IC5.8 | v83.5,63.02 83.19,63.34 IC2.16 | v15.72,75.56 15.4,75.25 15.4,57.15 15.08,56.83 15.08,55.88 v15.72,55.24 | 36.67,51.91 v33.66,54.93
  Bottom 0.152: v42.23,66.36 44.29,68.42 78.42,68.42 79.76,67.09 79.76,65.65 80.28,65.13 81.64,65.13 IC2.16 | v83.5,63.02 84.14,62.39 117.73,62.39 118.02,62.68 118.52,62.68 118.81,62.39 122.07,62.39 122.8,63.12 124.85,63.12 125.58,62.39 136.68,62.39 IC4.48 | v15.72,75.56 JP3.16 | v15.72,55.24 16.03,54.93 v33.66,54.93
IPL0  (via drill 0.35)
  Top 0.152: v17.3,63.34 18.73,64.77 18.73,78.9 18.41,79.22 v18.41,80.33 | v81.28,80.64 R7.1 78.74,74.93 IC1.25
  Bottom 0.152: JP3.26 10.64,63.34 v17.3,63.34 | v18.41,80.33 18.73,80.64 v81.28,80.64
IPL1
  Top 0.152: IC1.24 R6.1
  Bottom 0.152: JP3.28 8.73,61.75 6.67,61.75 3.97,64.45 3.97,75.72 5.08,76.83 11.75,76.83 12.06,77.15 12.22,77.15 12.38,77.15 24.13,77.15 24.45,76.83 43.81,76.83 44.45,76.2 74.93,76.2 R6.1
IPL2  (via drill 0.35)
  Top 0.152: R4.1 IC1.23 | IC4.32 141.13,26.19 141.13,72.07 138.43,74.77 v138.43,76.04 | JP3.30 9.05,58.9 9.05,75.88 10.28,77.11 11.07,77.11 v12.38,78.42
  Bottom 0.152: v138.43,76.04 137.48,76.99 102.87,76.99 101.12,75.25 86.2,75.25 83.03,78.42 74.61,78.42 R4.1 72.71,78.42 v12.38,78.42
LDS  (via drill 0.35)
  Top 0.152: v34.61,55.88 34.61,70.17 IC1.8 37.15,72.71 38.58,72.71 39.37,71.91 39.37,64.29 v40.8,62.87
  Bottom 0.152: IC5.18 21.11,60.17 15.08,60.17 10.79,55.88 | JP3.32 10.79,55.88 | 10.79,55.88 v34.61,55.88 | IC2.8 87.79,62.07 80.64,62.07 79.69,63.02 45.72,63.02 45.56,62.87 v40.8,62.87
MFPCLK
  Bottom 0.152: IC3.12 118.75,88.27 118.75,80.96 119.7,80.01 136.53,80.01 144.46,72.07 144.46,37.15 IC4.35
MFPIO0
  Top 0.152: IC4.22 118.11,17.14 LED1.K
MFPIO1
  Bottom 0.152: IC4.23 LED2.K
MFPXTAL1
  Top 0.152: C10.1 116.2,39.56 Q1.1 116.71,31.24 IC4.17
MFPXTAL2
  Top 0.152: IC4.18 111.89,33.53 Q1.2 111.12,39.81 C11.1
N$3
  Top 0.152: IC7.2 54.77,58.9 54.77,46.51 C21.1
  Bottom 0.152: R5.2 46.04,46.35 C21.1
N$4
  Top 0.152: C21.2 IC7.3
  Bottom 0.152: R10.1 55.88,47.62 C21.2
N$5
  Top 0.152: IC7.4 58.42,57.78 58.42,53.34 Q2.2
  Bottom 0.152: IC7.5 IC7.4 57.78,57.15 48.9,57.15 48.26,57.78 R10.2 | C22.1 Q2.2
N$6
  Top 0.152: IC7.1 52.07,54.61 53.34,53.34 Q2.1
  Bottom 0.152: R5.1 46.04,59.05 IC7.1 | C20.1 63.34,49.69 54.13,49.69 53.47,50.35 Q2.1
N$9
  Bottom 0.152: R3.1 111.76,8.89 LED2.A
N$10
  Top 0.152: LED1.A R2.1
N$16
  Bottom 0.152: IC6.7 124.46,83.82 IC6.11
N$19
  Top 0.152: C26.2 158.91,60.8 158.91,49.85 IC8.5
N$20
  Top 0.152: R14.2 146.05,86.36 LED3.K
N$22
  Top 0.152: IC6.10 131.29,83.03 131.29,89.69 IC6.14
N$23
  Top 0.152: IC6.6 120.17,85.57 120.17,92.23 IC6.2
N$33
  Top 0.152: IC9.10 116.2,58.42 117.47,59.69 117.47,72.23 127.48,82.23 127.48,93.98 128.43,94.93 132.08,94.93 LED4.K
N$34
  Top 0.152: LED4.A 137.48,87.31 R15.1
N$35  (via drill 0.35)
  Top 0.152: IC9.6 IC9.5 110.17,60.64 110.17,61.59 108.27,63.5 IC9.3 IC9.2 | LED3.A 143.51,71.75 141.92,70.17 v141.92,66.36 141.92,58.42 IC8.3
  Bottom 0.152: IC9.2 111.92,70.01 138.27,70.01 v141.92,66.36
N$36
  Top 0.152: R13.2 157.16,87.95 157.16,90.65 S1.3
N$37
  Top 0.152: S1.1 152.56,90.65 148.43,86.52 148.43,54.45 IC8.2 152.08,50.8 IC8.6 152.4,46.04 C25.+
  Top 0.254: R12.1 150.5,38.1 152.4,40.01 C25.+
ODDRAMSEL  (via drill 0.35)
  Top 0.152: v16.03,52.07 14.76,53.34 14.76,68.74 15.08,69.06 15.08,76.68 11.11,80.64 JP3.12 | IC2.13 89.85,65.72 89.85,53.18 90.17,52.86 v90.17,51.75 v90.17,16.99
  Bottom 0.152: v16.03,52.07 16.35,52.39 26.35,52.39 IC5.5 29.53,52.39 31.11,52.39 31.43,52.07 32.23,52.07 32.62,52.47 47.3,52.47 49.96,55.13 61.58,55.13 62.04,54.66 63.05,54.66 63.88,55.5 75.52,55.5 79.25,51.77 90.16,51.77 v90.17,51.75 | v90.17,16.99 89.38,17.78 U3.22
ODDROMSEL  (via drill 0.35)
  Top 0.152: v29.53,23.34 25.4,27.46 IC5.4 26.35,51.75 v26.35,62.39 26.67,62.71 26.67,75.56 v24.77,77.47
  Bottom 0.152: v29.53,23.34 30,22.86 U1.22 | IC2.15 83.66,64.61 46.35,64.61 45.56,65.41 40.96,65.41 37.94,62.39 v26.35,62.39 | JP3.14 10.79,77.47 v24.77,77.47
R/W  (via drill 0.35)
  Top 0.152: U4.29 107.95,36.83 107.95,46.54 109.97,48.56 120.64,48.56 121.47,49.4 121.47,62.41 IC4.1 | v25.4,63.98 IC5.17 | JP3.59 4.29,23.02 4.29,34.13 3.97,34.45 3.97,64.14 v4.6,64.77 | U3.29 78.26,41.12 v78.26,55.88 | v40.01,56.52 39.05,57.47 39.05,70.17 IC1.9
  Bottom 0.152: U3.29 84.93,34.45 105.57,34.45 U4.29 | IC1.9 36.51,69.53 32.54,69.53 26.99,63.98 v25.4,63.98 5.4,63.98 v4.6,64.77 | v78.26,55.88 77.63,56.52 v40.01,56.52
RESET  (via drill 0.35)
  Top 0.152: IC4.21 119.06,18.73 119.06,25.92 110.49,34.49 106.24,34.49 105.11,35.63 105.11,56.19 R17.1 | v105.41,60.48 103.5,58.58 R17.1 | IC1.18 61.28,70.8 v61.28,63.98 60.96,63.66 60.96,50.16 v59.05,48.26 | IC6.1 117.32,91.92 117.32,74.45 115.25,72.39 108.27,72.39 106.4,70.52 106.4,62.51 IC9.4 | R17.1 101.28,57.78 99.38,59.69 v99.38,63.66
  Bottom 0.152: IC9.4 107.47,60.48 v105.41,60.48 | v61.28,63.98 61.91,63.34 82.87,63.34 83.19,63.66 v99.38,63.66 | JP3.36 12.22,48.1 28.73,48.1 29.21,48.58 58.74,48.58 v59.05,48.26
UARTCLK
  Top 0.152: IC4.16 122.08,28.42 122.08,41.91 | IC4.7 122.08,47.78 122.08,41.91 | IC4.10 122.08,41.91
UARTCTS
  Top 0.152: IC4.29 136.84,14.29 136.84,3.49 135.57,2.22 135.56,2.23 83.47,2.23 82.83,1.6 66.07,1.6 65.44,2.23 21.27,2.23 18.43,5.08 JP1.4
UARTRX  (via drill 0.35)
  Top 0.152: IC4.9 125.57,42.7 v125.57,5.71
  Bottom 0.152: v125.57,5.71 121.44,1.59 12.38,1.59 JP1.3
UARTTX  (via drill 0.35)
  Top 0.152: IC4.8 125.88,44.94 125.88,6.84 126.05,6.67 v126.18,6.67
  Bottom 0.152: v126.18,6.67 126.18,5.21 122.24,1.27 10.16,1.27 JP1.2
UDS  (via drill 0.35)
  Top 0.152: IC1.7 31.75,69.85 v31.75,52.7 | IC2.7 87.63,58.42 v87.63,56.2
  Bottom 0.152: JP3.34 v31.75,52.7 32.43,52.7 32.76,53.03 47.43,53.03 49.9,55.51 61.63,55.51 62.17,54.97 62.92,54.97 63.83,55.87 75.58,55.87 79.38,52.07 83.5,52.07 v87.63,56.2
VCC
  pour Route15: 0,99.69 160.02,99.69 160.02,12.06 159.38,11.43 151.13,11.43 149.86,10.16 149.86,0 0,0
  pour Route15: 149.86,7.62 157.48,7.62 158.12,6.99 158.12,5.71 157.48,5.08 149.86,5.08
VPA
  Top 0.152: R1.1 68.26,71.44 IC1.21

## Text on the board
tNames: RUN RESET | 1 | 64 | rosco_m68k | revision 0 (prototype) | copyright 2019 | EXPANSION - SEE http://github.com/roscopeco/rosco_m68k | I0 | I1 | GND TXD RXD CTS | GND 5VDC
bNames: rosco_m68k / revision zero | copyright 2019